# EAGLE design rectifier (EAGLE 6.5.0)
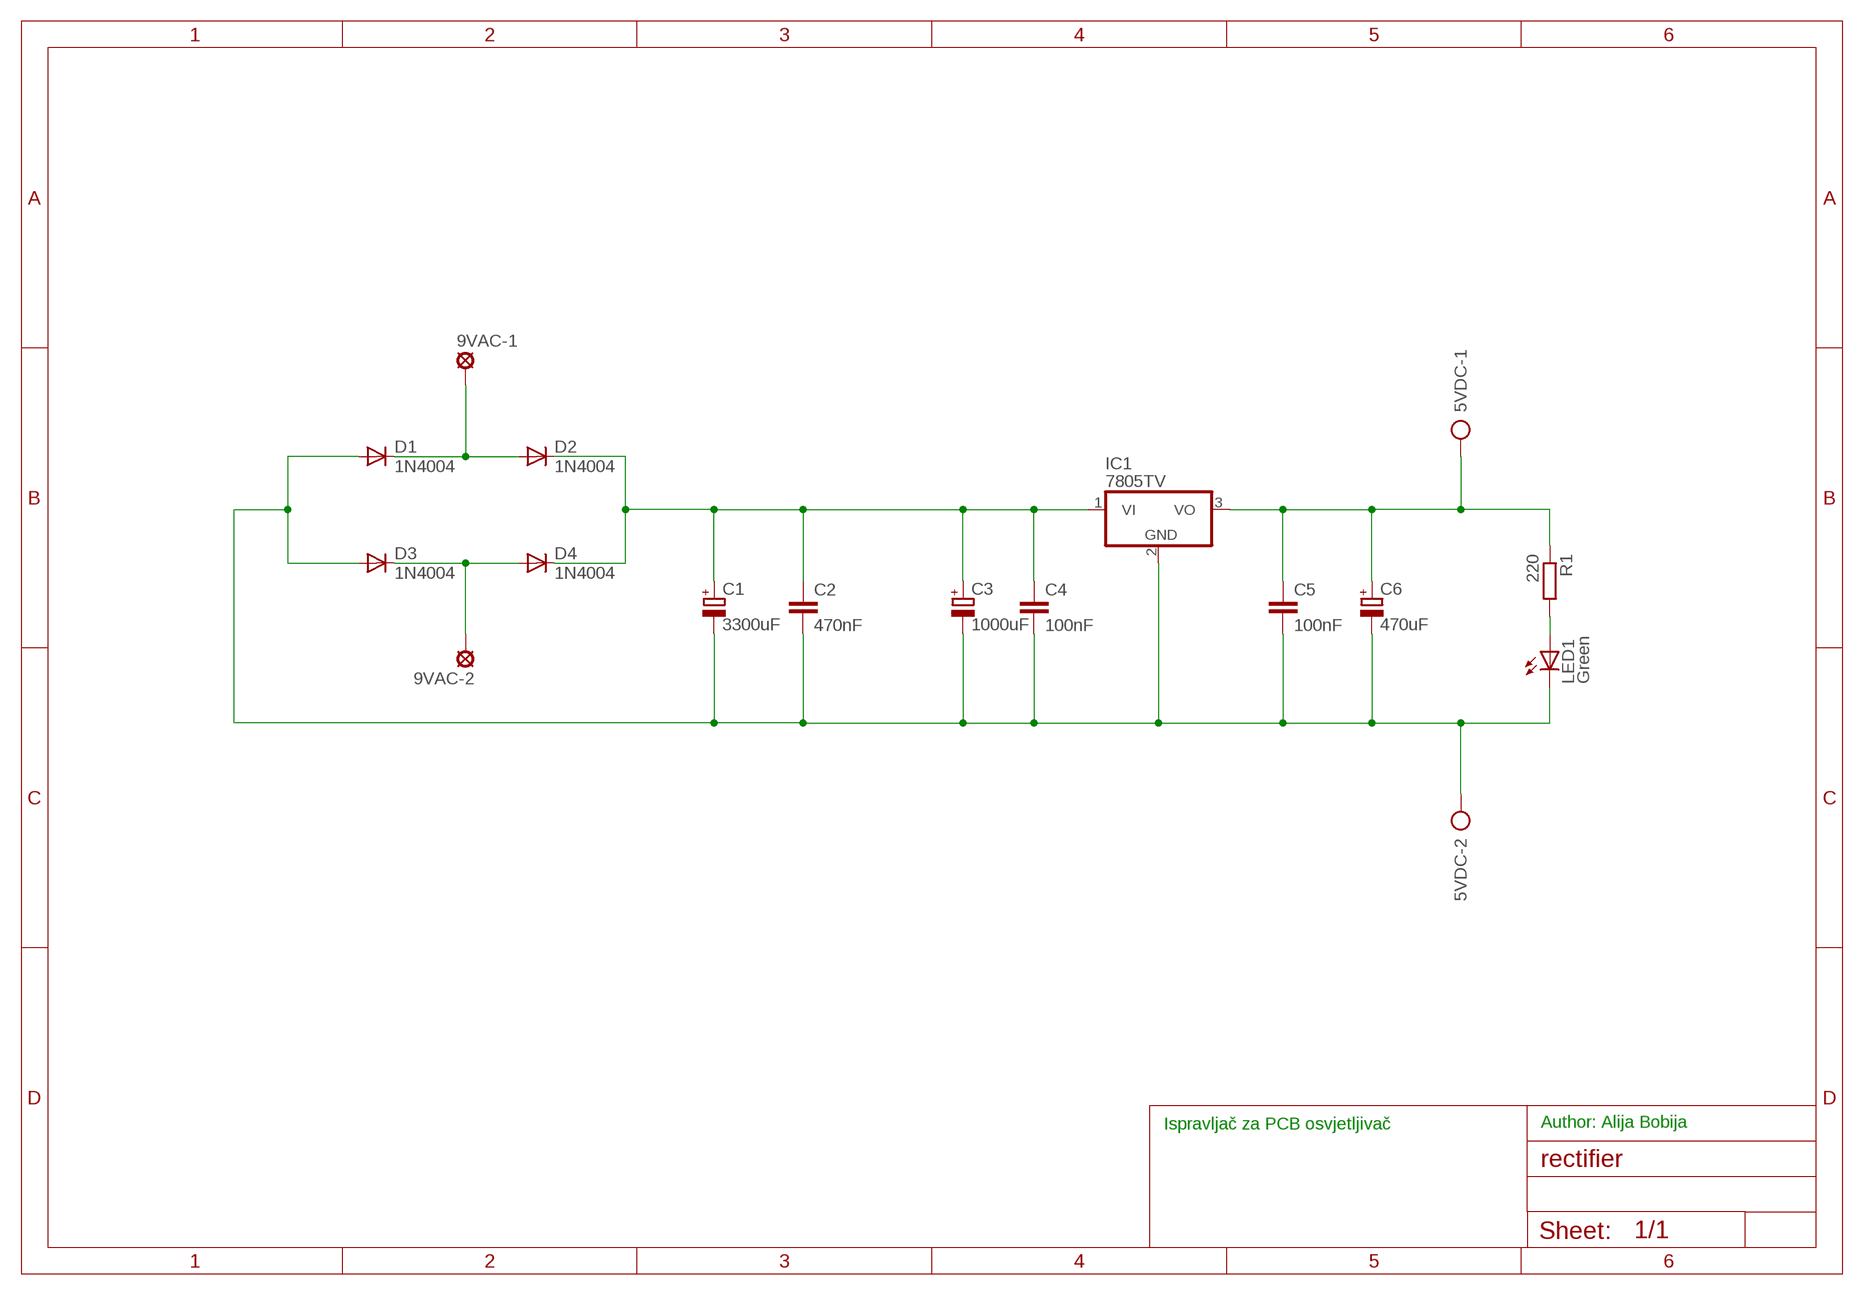
[diagram p0: schematic, sheet 1]

## Parts
5VDC  AK500/2  [AK500/2]
9VAC-1  LSP10  [LSP10]
9VAC-2  LSP10  [LSP10]
C1  3300uF  CPOL-EUE5-13  [E5-13]
C2  470nF  C-EU050-024X044  [C050-024X044]
C3  1000uF  CPOL-EUE3.5-10  [E3,5-10]
C4  100nF  C-EU025-024X044  [C025-024X044]
C5  100nF  C-EU025-024X044  [C025-024X044]
C6  470uF  CPOL-EUE3.5-8  [E3,5-8]
D1  1N4004  [DO41-10]
D2  1N4004  [DO41-10]
D3  1N4004  [DO41-10]
D4  1N4004  [DO41-10]
IC1  7805TV  [TO220V]
LED1  Green  LED3MM  [LED3MM]
R1  220  R-EU_M0805  [M0805]

## Nets
GND: 5VDC.2 C1.- C2.2 C3.- C4.2 C5.2 C6.- D1.A D3.A IC1.2(GND) LED1.K(C)
N$1: 9VAC-1.MP D1.C D2.A
N$2: 9VAC-2.MP D3.C D4.A
N$3: C1.+ C2.1 C3.+ C4.1 D2.C D4.C IC1.1(VI)
N$5: 5VDC.1 C5.1 C6.+ IC1.3(VO) R1.1
N$6: LED1.A R1.2

## Notes on the sheet
- Ispravljač za PCB osvjetljivač | Author: Alija Bobija

## Library data of the parts
5VDC = con-ptr500:AK500/2: CONNECTOR; OC_FARNELL: unknown; OC_NEWARK: unknown
9VAC-1 9VAC-2 = solpad:LSP10: SOLDER PAD drill 1.0 mm, distributor Buerklin, 12H555
C1 = resistor:CPOL-EU: POLARIZED CAPACITOR, European symbol
C2 = resistor:C-EU: CAPACITOR, European symbol
C3 C6 = rcl:CPOL-EU: POLARIZED CAPACITOR, European symbol
C4 C5 = rcl:C-EU: CAPACITOR, European symbol
D1-D4 = diode:1N4004: DIODE general purpose rectifier, 1 A
IC1 = linear:78*: Positive VOLTAGE REGULATOR Source: http://cache.national.com/ds/LM/LM78L05.pdf http://www.fairchildsemi.com/ds/LM/LM7805.pdf
LED1 = sparkfun-LED:LED: LEDs Standard schematic elements and footprints for 5mm, 3mm, 1206, and 0603 sized LEDs. 5mm - Spark Fun Electronics SKU : COM-00529 (and others)
R1 = rcl:R-EU_: RESISTOR, European symbol

## Board
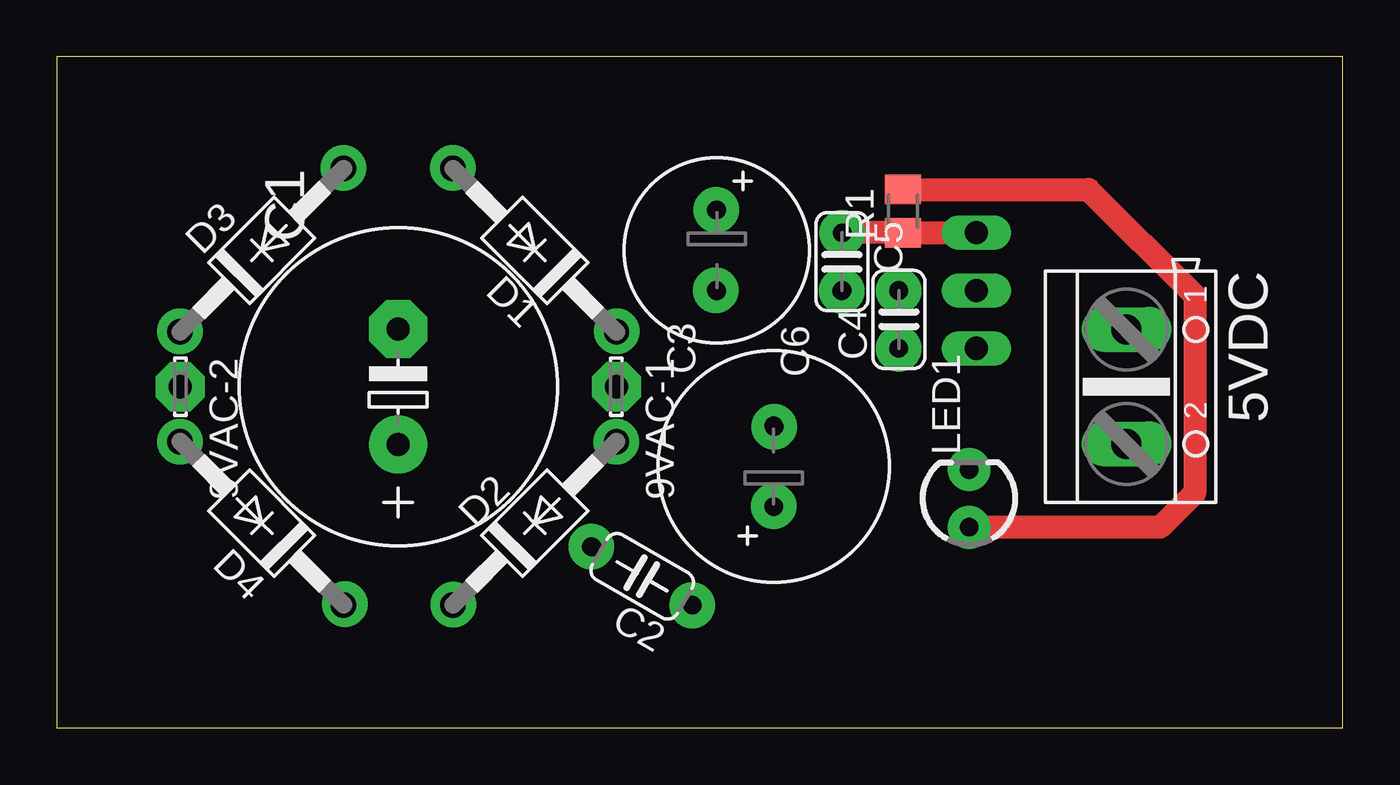
[diagram p1: board, top side]
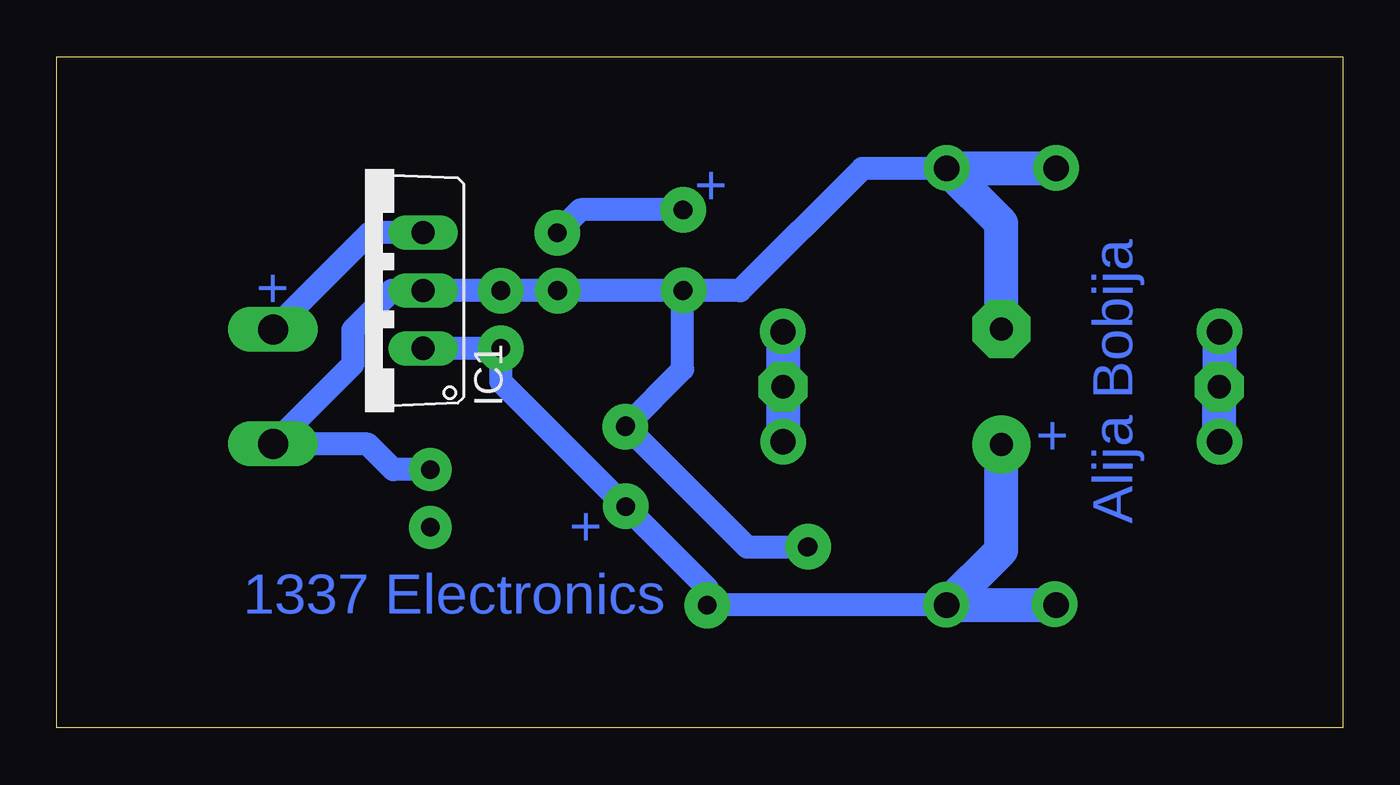
[diagram p2: board, bottom side, seen from below]

Size 56.5 x 29.5 mm. Coordinates in mm from the lower left corner, seen from the top.
Outline: 0,0 56.5,0 56.5,29.5 0,29.5 0,0
Copper layers (1*16): Top 0.035mm / dielectric 1.5mm / Bottom 0.035mm
Design rules "default": minimum track width 10mil, minimum drill 24mil, track to track 8mil, track to pad 8mil, pad to pad 8mil, via to via 8mil, smd to smd 8mil, copper to edge 40mil, drill to drill 8mil, minimum pad ring 10mil, minimum via ring 8mil, stop-mask expansion 4mil, vias tented up to drill 0mil, thermal gap 10mil

### Footprints (pad centres in the part's own frame; a part is rotated, then mirrored left to right if it is on the bottom)
AK500/2 = drill 1.321 long: 1 -2.515,0; 2 2.515,0
LSP10 = drill 1.016 pad 2.159 octagon: MP 0,0
E5-13 = drill 1.016 pad 2.54: + -2.54,0 | drill 1.016 pad 2.54 octagon: - 2.54,0
C050-024X044 = drill 0.813 octagon: 1 -2.54,0; 2 2.54,0
E3,5-10 = drill 0.813 pad 1.6: + -1.778,0 | drill 0.813 pad 1.6 octagon: - 1.778,0
C025-024X044 = drill 0.813 octagon: 1 -1.27,0; 2 1.27,0
E3,5-8 = drill 0.813 pad 1.6: + -1.778,0 | drill 0.813 pad 1.6 octagon: - 1.778,0
DO41-10 = drill 1.118: A 5.08,0; C -5.08,0
TO220V = drill 1.016 long: 1 -2.54,-2.54; 2 0,-2.54; 3 2.54,-2.54
LED3MM = drill 0.813 pad 1.88: A -1.27,0; K 1.27,0
M0805 = smd 1.3 x 1.6: 1 -0.95,0; 2 0.95,0

### Placement (x,y rotation side)
5VDC  47,15 270 top
9VAC-1  24.59,15 270 top
9VAC-2  5.42,15 270 top
C1  15,15 90 top
C2  25.72,6.67 150 top
C3  31.5,11.5 90 top
C4  37,17.96 90 top
C5  34.5,20.5 270 top
C6  29,21 270 top
D1  21,21 135 top
D2  21,9 45 top
D3  9,21 45 top
D4  9,9 135 top
IC1  42.95,19.23 90 bottom
LED1  40.09,10.09 90 top
R1  37.18,22.72 90 top

### Tracks (layer width: path | path; a pad name or v marks a point on that pad's centre or on a via)
GND
  Bottom 1: D1.A 21.11,24.59 26.48,19.22 C6.- | C6.- 29,15.78 C3.- 26.16,7.94 C2.2 | C6.- C5.2 C4.2 IC1.2 41.77,19.23 43.5,17.5 43.5,15.98 5VDC.2 42.84,12.48 41.72,11.36 LED1.K
  Bottom 1.5: D3.A D1.A 15,22.18 C1.-
N$1
  Bottom 1.5: D1.C 9VAC-1.MP D2.A
N$2
  Bottom 1.5: D4.A 9VAC-2.MP 5.41,15 D3.C
N$3
  Bottom 1: IC1.1 C4.1 37,15.22 C3.+ 27.92,6.14 C2.1 D2.C
  Bottom 1.5: D4.C D2.C 15,7.82 C1.+
N$4  (via drill 0.8 pad 2)
  other vias: 12.59,24.63
N$5  (via drill 0.8 pad 2)
  Top 1: C5.1 v34.52,21.77 R1.1 IC1.3
  Bottom 1: C6.+ 33.49,22.78 C5.1 | IC1.3 42.74,21.77 5VDC.1
N$6
  Top 1: R1.2 45.33,23.67 50,19 50,10.33 48.49,8.82 LED1.A
N$7  (via drill 0.8 pad 2)
  other vias: 17.39,24.63
N$8  (via drill 0.8 pad 2)
  other vias: 12.66,5.45
N$9  (via drill 0.8 pad 2)
  other vias: 17.42,5.42
N$10  (via drill 0.8 pad 2)
  other vias: 27.93,5.39
N$11  (via drill 0.8 pad 2)
  other vias: 23.48,7.97
N$12  (via drill 0.8 pad 2)
  other vias: 24.58,12.59
N$13  (via drill 0.8 pad 2)
  other vias: 24.61,17.43
N$14  (via drill 0.8 pad 2)
  other vias: 5.4,12.59
N$15  (via drill 0.8 pad 2)
  other vias: 5.4,17.43
N$16  (via drill 0.8 pad 2)
  other vias: 31.5,9.74
N$17  (via drill 0.8 pad 2)
  other vias: 31.52,13.24
N$18  (via drill 0.8 pad 2)
  other vias: 28.96,19.24
N$19  (via drill 0.8 pad 2)
  other vias: 28.97,22.77
N$20  (via drill 0.8 pad 2)
  other vias: 36.99,19.21
N$21  (via drill 0.8 pad 2)
  other vias: 36.99,16.68
N$22  (via drill 0.8 pad 2)
  other vias: 34.49,19.21

### Text on the board
Bottom: + | Alija Bobija | + | + | + | 1337 Electronics